# Altium schematic sheet Overwiev.SchDoc
size A4; SheetNumber: 1; SheetTotal: 4
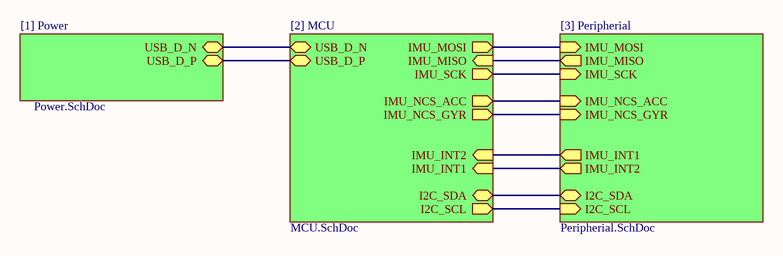
[diagram p0: Overwiev.SchDoc]

## Sub-sheets
[1] Power = Power.SchDoc: USB_D_N (bidir), USB_D_P (bidir)
[2] MCU = MCU.SchDoc: USB_D_N (bidir), USB_D_P (bidir), IMU_SCK (out), IMU_MISO (in), IMU_MOSI (out), IMU_NCS_ACC (out), IMU_NCS_GYR (out), I2C_SDA (bidir), I2C_SCL (out), IMU_INT2 (in), IMU_INT1 (in)
[3] Peripherial = Peripherial.SchDoc: IMU_INT2 (out), IMU_INT1 (out), IMU_SCK (in), IMU_MOSI (in), IMU_MISO (out), IMU_NCS_ACC (in), IMU_NCS_GYR (in), I2C_SCL (in), I2C_SDA (bidir)

## Nets
(unnamed): sheet [1] Power/USB_D_N, sheet [2] MCU/USB_D_N
(unnamed): sheet [1] Power/USB_D_P, sheet [2] MCU/USB_D_P
(unnamed): sheet [2] MCU/IMU_SCK, sheet [3] Peripherial/IMU_SCK
(unnamed): sheet [2] MCU/IMU_MISO, sheet [3] Peripherial/IMU_MISO
(unnamed): sheet [2] MCU/IMU_MOSI, sheet [3] Peripherial/IMU_MOSI
(unnamed): sheet [2] MCU/IMU_NCS_ACC, sheet [3] Peripherial/IMU_NCS_ACC
(unnamed): sheet [2] MCU/IMU_NCS_GYR, sheet [3] Peripherial/IMU_NCS_GYR
(unnamed): sheet [2] MCU/I2C_SDA, sheet [3] Peripherial/I2C_SDA
(unnamed): sheet [2] MCU/I2C_SCL, sheet [3] Peripherial/I2C_SCL
(unnamed): sheet [2] MCU/IMU_INT2, sheet [3] Peripherial/IMU_INT1
(unnamed): sheet [2] MCU/IMU_INT1, sheet [3] Peripherial/IMU_INT2